# Altium schematic sheet LCD3.5.SchDoc
size A4
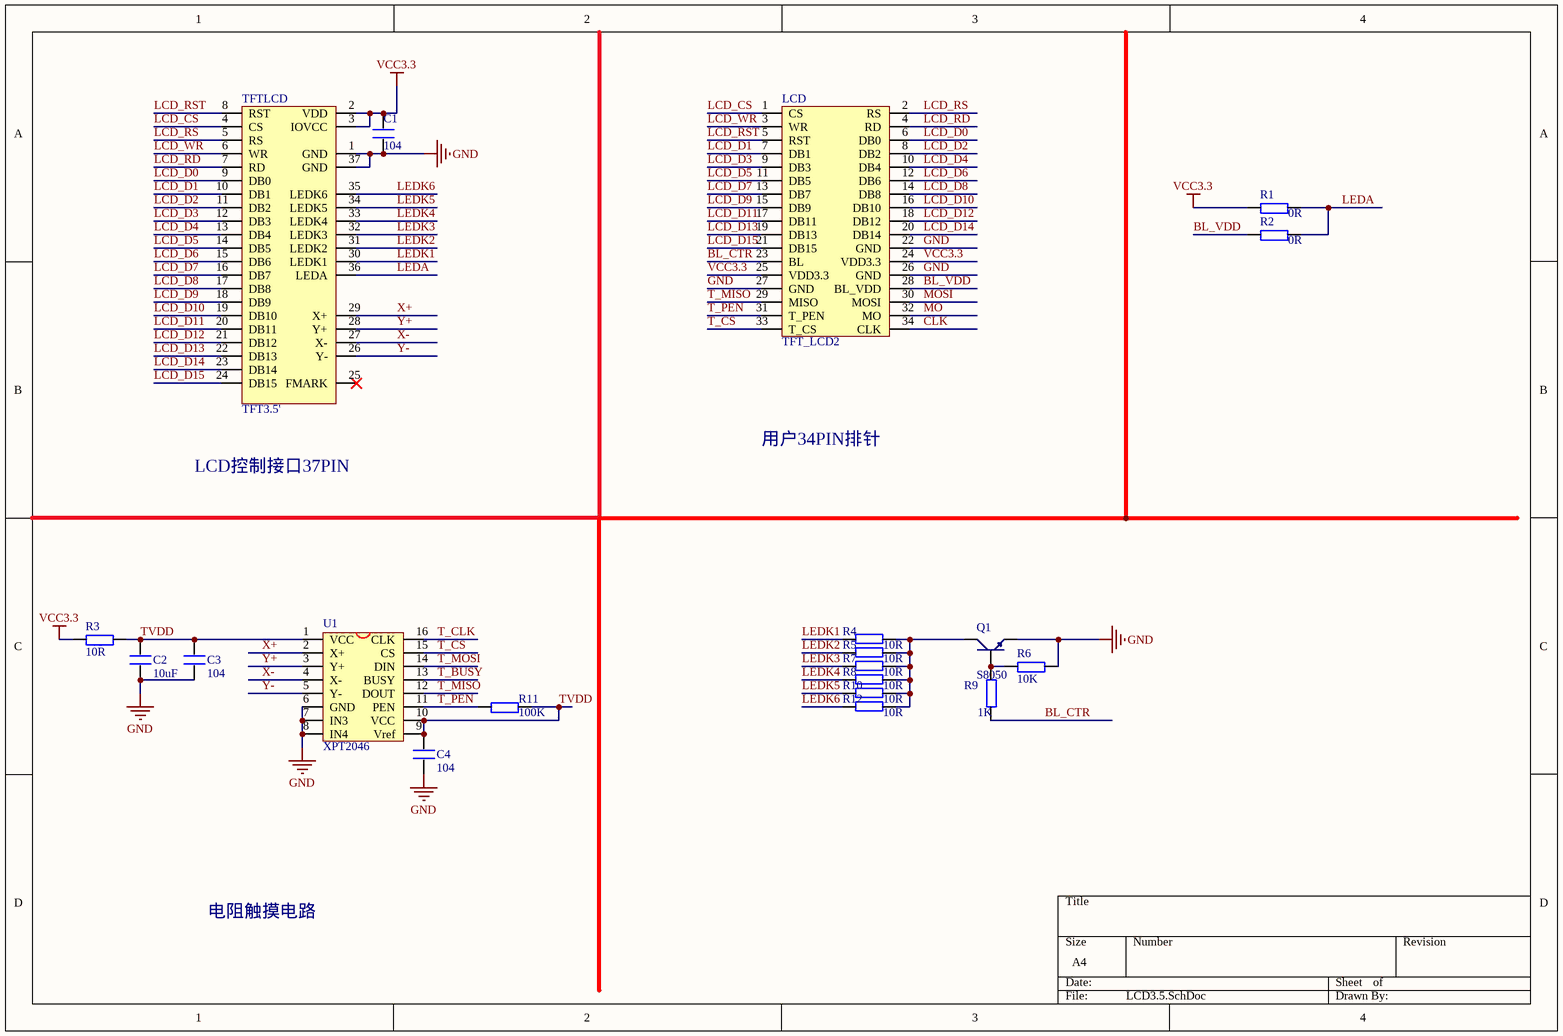
[diagram p0: LCD3.5.SchDoc]

## Parts
C1  104  [0603P]
C2  10uF  [0603P]
C3  104  [0603P]
C4  104  [0603P]
LCD  TFT_LCD2  [DB2*17-3.5]
Q1  S8050  [SOT-23R]
R1  0R  [0603P]
R2  0R  [0603P]
R3  10R  [0603P]
R4  10R  [0603P]
R5  10R  [0603P]
R6  10K  [0603P]
R7  10R  [0603P]
R8  10R  [0603P]
R9  1K  [0603P]
R10  10R  [0603P]
R11  100K  [0603P]
R12  10R  [0603P]
TFTLCD  TFT3.5'  [TFT3.5']
U1  XPT2046  [SSOP16]

## Nets
GND: C1.1 C2.1 C3.1 C4.1 LCD.22(GND) LCD.26(GND) LCD.27(GND) Q1.1(E) R6.2 TFTLCD.1(GND) TFTLCD.37(GND) U1.6(GND) U1.7(IN3) U1.8(IN4)
VCC3.3: C1.2 LCD.24(VDD3.3) LCD.25(VDD3.3) R1.1 R3.1 TFTLCD.2(VDD) TFTLCD.3(IOVCC)
BL_CTR: LCD.23(BL) R9.1
BL_VDD: LCD.28(BL_VDD) R2.1
CLK: LCD.34(CLK)
LCD_CS: LCD.1(CS) TFTLCD.4(CS)
LCD_D0: LCD.6(DB0) TFTLCD.9(DB0)
LCD_D1: LCD.7(DB1) TFTLCD.10(DB1)
LCD_D2: LCD.8(DB2) TFTLCD.11(DB2)
LCD_D3: LCD.9(DB3) TFTLCD.12(DB3)
LCD_D4: LCD.10(DB4) TFTLCD.13(DB4)
LCD_D5: LCD.11(DB5) TFTLCD.14(DB5)
LCD_D6: LCD.12(DB6) TFTLCD.15(DB6)
LCD_D7: LCD.13(DB7) TFTLCD.16(DB7)
LCD_D8: LCD.14(DB8) TFTLCD.17(DB8)
LCD_D9: LCD.15(DB9) TFTLCD.18(DB9)
LCD_D10: LCD.16(DB10) TFTLCD.19(DB10)
LCD_D11: LCD.17(DB11) TFTLCD.20(DB11)
LCD_D12: LCD.18(DB12) TFTLCD.21(DB12)
LCD_D13: LCD.19(DB13) TFTLCD.22(DB13)
LCD_D14: LCD.20(DB14) TFTLCD.23(DB14)
LCD_D15: LCD.21(DB15) TFTLCD.24(DB15)
LCD_RD: LCD.4(RD) TFTLCD.7(RD)
LCD_RS: LCD.2(RS) TFTLCD.5(RS)
LCD_RST: LCD.5(RST) TFTLCD.8(RST)
LCD_WR: LCD.3(WR) TFTLCD.6(WR)
LEDA: R1.2 R2.2 TFTLCD.36(LEDA)
LEDK1: R4.2 TFTLCD.30(LEDK1)
LEDK2: R5.2 TFTLCD.31(LEDK2)
LEDK3: R7.2 TFTLCD.32(LEDK3)
LEDK4: R8.2 TFTLCD.33(LEDK4)
LEDK5: R10.2 TFTLCD.34(LEDK5)
LEDK6: R12.2 TFTLCD.35(LEDK6)
MO: LCD.32(MO)
MOSI: LCD.30(MOSI)
T_BUSY: U1.13(BUSY)
T_CLK: U1.16(CLK)
T_CS: LCD.33(T_CS) U1.15(CS)
T_MISO: LCD.29(MISO) U1.12(DOUT)
T_MOSI: U1.14(DIN)
T_PEN: LCD.31(T_PEN) R11.1 U1.11(PEN)
TVDD: C2.2 C3.2 C4.2 R3.2 R11.2 U1.1(VCC) U1.9(Vref) U1.10(VCC)
X+: TFTLCD.29(X+) U1.2(X+)
X-: TFTLCD.27(X-) U1.4(X-)
Y+: TFTLCD.28(Y+) U1.3(Y+)
Y-: TFTLCD.26(Y-) U1.5(Y-)
NetQ1_2: Q1.2(B) R6.1 R9.2
NetQ1_3: Q1.3(C) R4.1 R5.1 R7.1 R8.1 R10.1 R12.1

Not connected (* = marked no-connect by the designer): TFTLCD 25(FMARK)*

## Notes on the sheet
- 用户34PIN排针
- LCD控制接口37PIN
- 电阻触摸电路

## Library data of the parts
C1-C4 = C
Q1 = NPN: 8050/BCW846/BCW847
R1-R12 = R
TFTLCD = TFT3.5': 3.5寸,带触摸,分辨率:480*320
U1 = ADS7843